# Altium schematic sheet RP2040_Extender.SchDoc: STM32F446 CNC
size B; Author: AM; CompanyName: Expatria Technologies; DrawnBy: A.Marles; Engineer: AM; Organization: Expatria Technologies; DocumentNumber: 3; SheetNumber: 3; SheetTotal: 14
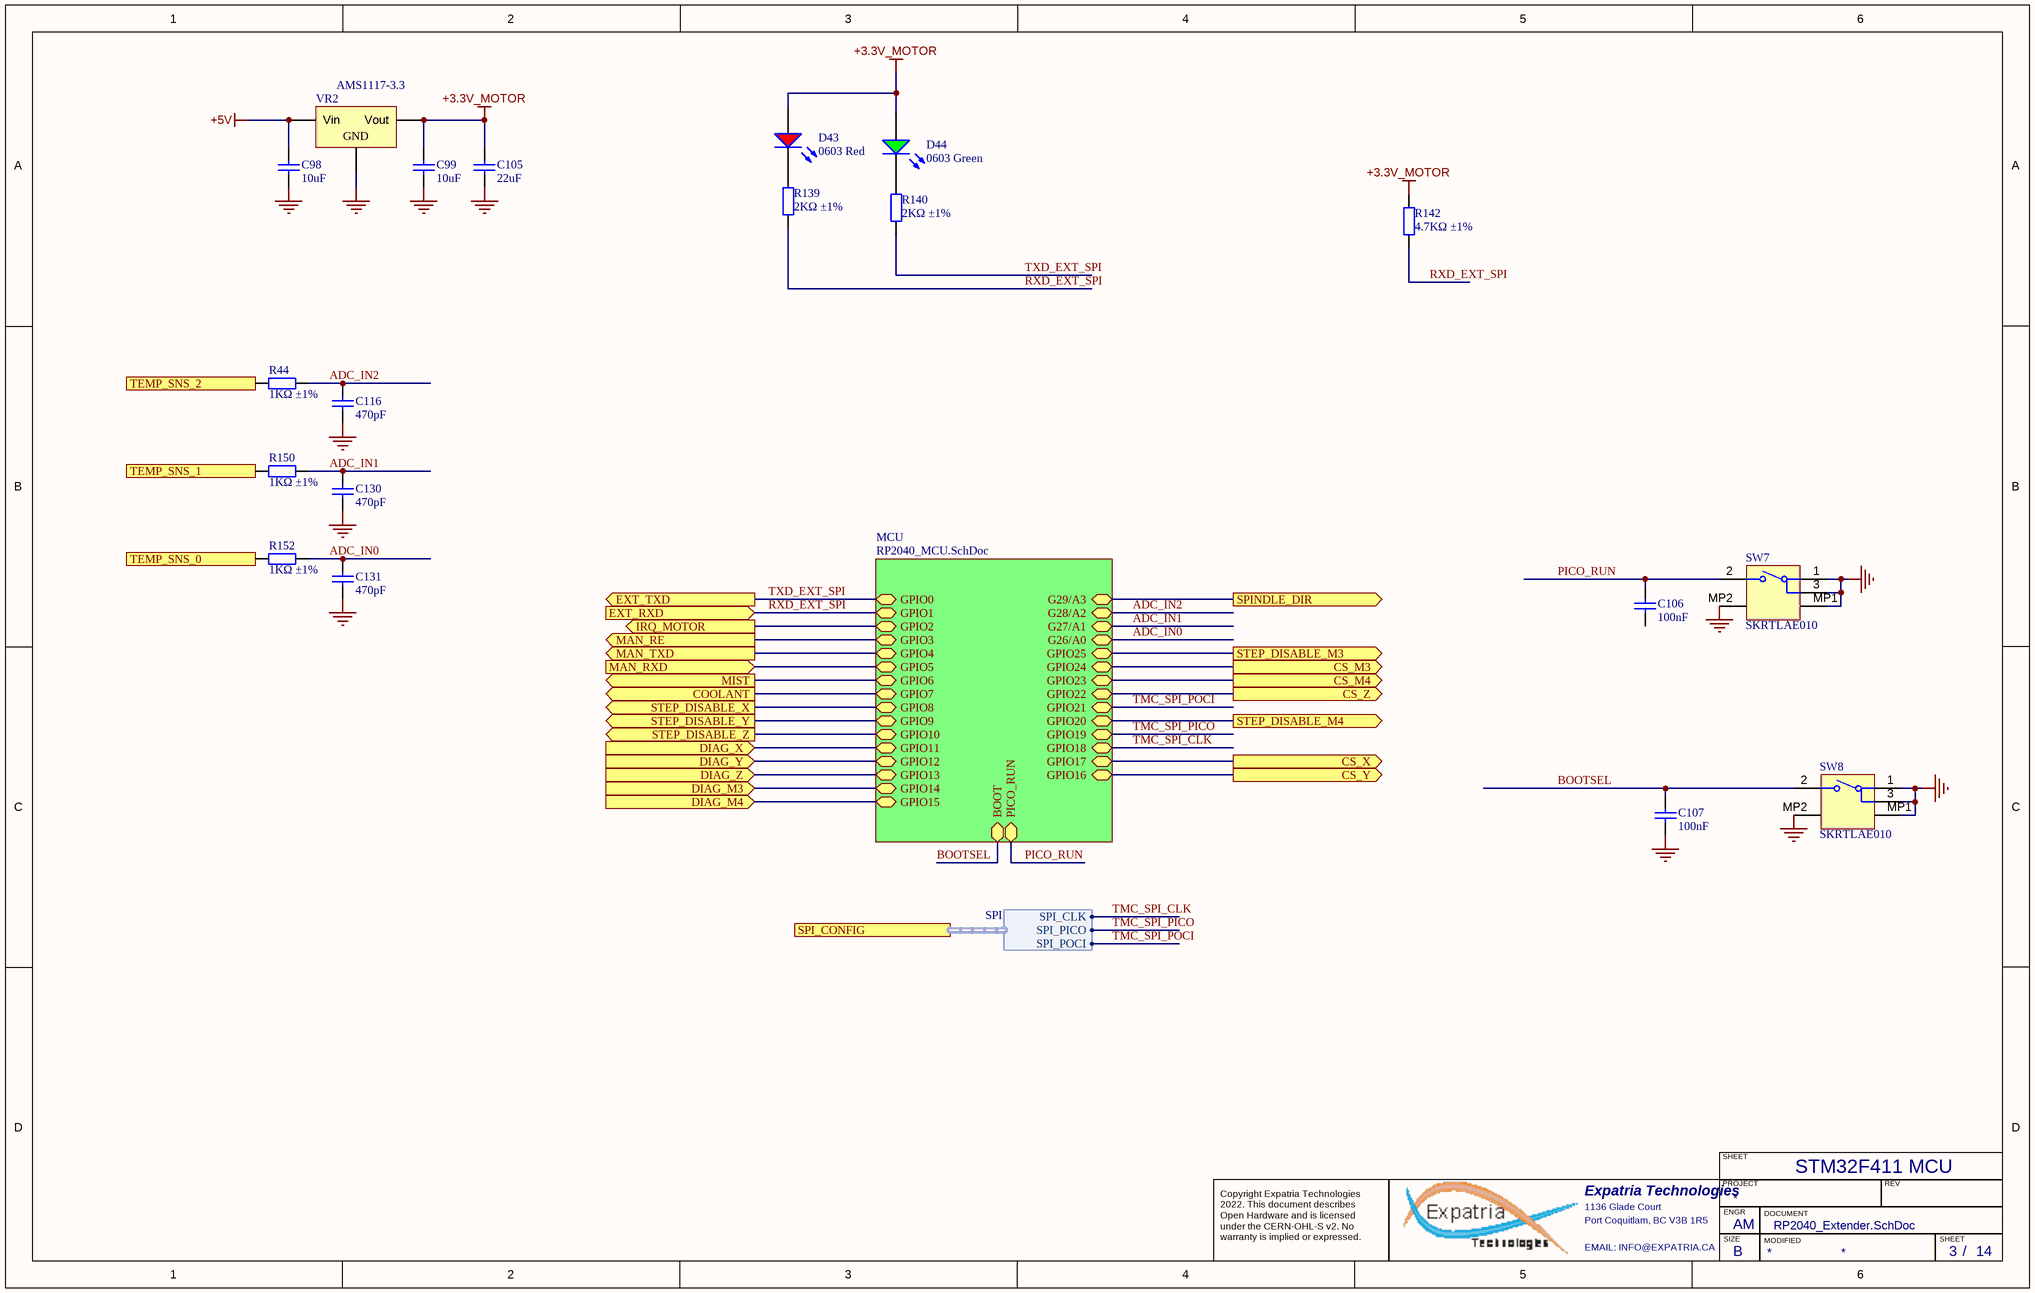
[diagram p0: RP2040_Extender.SchDoc]

## Parts
C98  10uF  [1206_C]
C99  10uF  [1206_C]
C105  22uF  [0805_C]
C106  100nF  [0402_C]  (no BOM)
C107  100nF  [0402_C]  (no BOM)
C116  470pF  [0603_C]
C130  470pF  [0603_C]
C131  470pF  [0603_C]
D43  0603 Red  [0603_LED_S1]
D44  0603 Green  [0603_LED_S1]
R44  1KΩ ±1%  [0603_R]
R139  2KΩ ±1%  [0603_R]
R140  2KΩ ±1%  [0603_R]
R142  4.7KΩ ±1%  [0603_R]
R150  1KΩ ±1%  [0603_R]
R152  1KΩ ±1%  [0603_R]
SW7  SKRTLAE010  [ALPS-SKRTLAE010_V]
SW8  SKRTLAE010  [ALPS-SKRTLAE010_V]
VR2  AMS1117-3.3  [SOT-223]

## Sub-sheets
MCU = RP2040_MCU.SchDoc: G28/A2 (bidir), GPIO20 (bidir), GPIO14 (bidir), GPIO25 (bidir), GPIO15 (bidir), GPIO8 (bidir), GPIO1 (bidir), G27/A1 (bidir), GPIO0 (bidir), GPIO13 (bidir), G26/A0 (bidir), GPIO21 (bidir), PICO_RUN (bidir), G29/A3 (bidir), GPIO7 (bidir), GPIO6 (bidir), GPIO12 (bidir), GPIO2 (bidir), GPIO4 (bidir), GPIO17 (bidir), GPIO10 (bidir), GPIO11 (bidir), GPIO23 (bidir), GPIO22 (bidir), GPIO18 (bidir), GPIO5 (bidir), GPIO9 (bidir), GPIO3 (bidir), GPIO24 (bidir), GPIO19 (bidir), GPIO16 (bidir), BOOT (bidir)

## Ports
COOLANT (out), CS_M3 (out), CS_M4 (out), CS_X (out), CS_Y (out), CS_Z (out), DIAG_M3 (in), DIAG_M4 (in), DIAG_X (in), DIAG_Y (in), DIAG_Z (in), EXT_RXD (in), EXT_TXD (out), IRQ_MOTOR (out), MAN_RE (out), MAN_RXD (in), MAN_TXD (out), MIST (out), SPI_CONFIG (harness SPI), SPINDLE_DIR (out), STEP_DISABLE_M3 (out), STEP_DISABLE_M4 (out), STEP_DISABLE_X (out), STEP_DISABLE_Y (out), STEP_DISABLE_Z (out), TEMP_SNS_0 (in), TEMP_SNS_1 (in), TEMP_SNS_2 (in)

## Harnesses
SPI: SPI_CLK, SPI_PICO, SPI_POCI

## Nets
+3.3V_MOTOR: C99.2 C105.2 D43.A D44.A R142.2 VR2.2(Vout)
+5V: C98.2 VR2.3(Vin)
GND: C98.1 C99.1 C105.1 C107.1 C116.1 C130.1 C131.1 SW7.1 SW7.3 SW7.MP1 SW7.MP2 SW8.1 SW8.3 SW8.MP1 SW8.MP2 VR2.1(GND)
ADC_IN0: C131.2 R152.2 ; sheet MCU/G26/A0
ADC_IN1: C130.2 R150.2 ; sheet MCU/G27/A1
ADC_IN2: C116.2 R44.2 ; sheet MCU/G28/A2
BOOTSEL: C107.2 SW8.2 ; sheet MCU/BOOT
COOLANT: port COOLANT, sheet MCU/GPIO7
CS_M3: port CS_M3, sheet MCU/GPIO24
CS_M4: port CS_M4, sheet MCU/GPIO23
CS_X: port CS_X, sheet MCU/GPIO17
CS_Y: port CS_Y, sheet MCU/GPIO16
CS_Z: port CS_Z, sheet MCU/GPIO22
DIAG_M3: port DIAG_M3, sheet MCU/GPIO14
DIAG_M4: port DIAG_M4, sheet MCU/GPIO15
DIAG_X: port DIAG_X, sheet MCU/GPIO11
DIAG_Y: port DIAG_Y, sheet MCU/GPIO12
DIAG_Z: port DIAG_Z, sheet MCU/GPIO13
IRQ_MOTOR: port IRQ_MOTOR, sheet MCU/GPIO2
MAN_RE: port MAN_RE, sheet MCU/GPIO3
MAN_RXD: port MAN_RXD, sheet MCU/GPIO5
MAN_TXD: port MAN_TXD, sheet MCU/GPIO4
MIST: port MIST, sheet MCU/GPIO6
PICO_RUN: C106.2 SW7.2 ; sheet MCU/PICO_RUN
RXD_EXT_SPI: R139.1 R142.1 ; port EXT_RXD, sheet MCU/GPIO1
SPINDLE_DIR: port SPINDLE_DIR, sheet MCU/G29/A3
STEP_DISABLE_M3: port STEP_DISABLE_M3, sheet MCU/GPIO25
STEP_DISABLE_M4: port STEP_DISABLE_M4, sheet MCU/GPIO20
STEP_DISABLE_X: port STEP_DISABLE_X, sheet MCU/GPIO8
STEP_DISABLE_Y: port STEP_DISABLE_Y, sheet MCU/GPIO9
STEP_DISABLE_Z: port STEP_DISABLE_Z, sheet MCU/GPIO10
TEMP_SNS_0: R152.1 ; port TEMP_SNS_0
TEMP_SNS_1: R150.1 ; port TEMP_SNS_1
TEMP_SNS_2: R44.1 ; port TEMP_SNS_2
TMC_SPI_CLK: sheet MCU/GPIO18, port SPI_CONFIG.SPI_CLK
TMC_SPI_PICO: sheet MCU/GPIO19, port SPI_CONFIG.SPI_PICO
TMC_SPI_POCI: sheet MCU/GPIO21, port SPI_CONFIG.SPI_POCI
TXD_EXT_SPI: R140.1 ; port EXT_TXD, sheet MCU/GPIO0
NetD43_K: D43.K R139.2
NetD44_K: D44.K R140.2

Not connected (* = marked no-connect by the designer): C106 1

## Notes on the sheet
- STM32F411 MCU
- SHEET
- Expatria Technologies
- 1136 Glade Court
- Port Coquitlam, BC V3B 1R5
- PROJECT
- SIZE
- ENGR
- MODIFIED
- DOCUMENT
- REV
- Copyright Expatria Technologies 2022. This document describes Open Hardware and is licensed under the CERN-OHL-S v2. No warranty is implied or expressed.
- EMAIL: INFO@EXPATRIA.CA
- B
- /

## Library data of the parts
C98 C99 = 1206 10uF (106) 10% 50V: Chip capacitors; Manufacturer: Samsung Electro-Mechanics; PartNumber: CL31A106KBHNNNE; Tolerance: 10%; Voltage: 50V; ComponentLink1Description: Supplier link; ComponentLink1URL: http://www.szlcsc.com/product/details_14236.html; Package: 1206; Supplier: LC; SuppliersPartNumber: C13585; Capacitance: 10uF; Manufacturer 1: Samsung Electro-Mechanics
C105 = 0805 22uF (226) 20% 25V: Chip capacitors; Manufacturer: Samsung Electro-Mechanics; PartNumber: CL21A226MAQNNNE; Tolerance: 20%; Voltage: 25V; Package: 0805; Supplier: LC; SuppliersPartNumber: C2922481; Capacitance: 22uF; ComponentLink1Description: Supplier link; ComponentLink1URL: http://www.szlcsc.com/product/details_46786.html
C106 C107 = 0402 100nF (104) 10% 16V: Chip capacitors; Manufacturer: Samsung Electro-Mechanics; PartNumber: CL05B104KO5NNNC; Tolerance: 10%; Voltage: 16V; ComponentLink1Description: Supplier link; ComponentLink1URL: http://www.szlcsc.com/product/details_1877.html; Package: 0402; Supplier: LC; SuppliersPartNumber: C1525; Capacitance: 100nF
C116 C130 C131 = 0603 470pF (471) 10% 50V: Chip capacitors; Manufacturer: Guangdong Fenghua Advanced Tech; PartNumber: 0603B471K500NT; Tolerance: 10%; Voltage: 50V; ComponentLink1Description: Supplier link; ComponentLink1URL: http://www.szlcsc.com/product/details_1972.html; Package: 0603; Supplier: LC; SuppliersPartNumber: C1620; Capacitance: 470pF
D43 = 0603 LED Red: LED; ComponentLink1Description: 供应商链接; ComponentLink1URL: http://www.szlcsc.com/product/details_2659.html; Package: 0603; Supplier: LC; SuppliersPartNumber: C2286; Color: Red
D44 = 0603 LED Green: LED; ComponentLink1Description: 供应商链接; ComponentLink1URL: http://www.szlcsc.com/product/details_73152.html; Package: 0603; Supplier: LC; SuppliersPartNumber: C72043; Color: Green
R44 R150 R152 = 0603 1K (1001) 1%: Chip resistor; Manufacturer: Uniroyal Elec; PartNumber: 0603WAF1001T5E; Power: 1/10W; ComponentLink1Description: Supplier link; ComponentLink1URL: http://www.szlcsc.com/product/details_21904.html; Package: 0603; Supplier: LC; SuppliersPartNumber: C21190; Resistance: 1KΩ; Tolerance: 1%
R139 R140 = 0603 2K (2001) 1%: Chip resistor; Manufacturer: Uniroyal Elec; PartNumber: 0603WAF2001T5E; Power: 1/10W; ComponentLink1Description: Supplier link; ComponentLink1URL: http://www.szlcsc.com/product/details_23702.html; Package: 0603; Supplier: LC; SuppliersPartNumber: C22975; Resistance: 2KΩ; Tolerance: 1%
R142 = 0603 4.7K (4701) 1%: Chip resistor; Manufacturer: Uniroyal Elec; PartNumber: 0603WAF4701T5E; Power: 1/10W; ComponentLink1Description: Supplier link; ComponentLink1URL: http://www.szlcsc.com/product/details_23889.html; Package: 0603; Supplier: LC; SuppliersPartNumber: C23162; Resistance: 4.7KΩ; Tolerance: 1%
SW7 SW8 = CMP-2000-07073-2: Side Push Type, 250 V, -40 to 90 degC, 3-Pin SMD, RoHS, Tape and Reel; Manufacturer: ALPS; Operating Force: 1.6N; Folder: Unified Components\Components\New Releases\New\; Maximum Current Rating: 0.05@12VDCA; RevisionId: 1; Pole Throw Configuration: SPST; Switch Configuration: N.O.; AccessRights: 2147483647; Maximum DC Voltage Rating: 12V; ContentType: Unified Component; Rad Hard: No; Mounting: SurfaceMount; Datasheet URL: http://www.alps.com/prod/info/E/PDF/Tact/SurfaceMount/SKRT/SKRT.PDF; Manufacturer URL: http://www.alps.com/e/; ReleaseDate: 22/09/2017 06:13:25 AM; ItemHRID: CMP-2000-07073; ContentTypeGUID: CB3C11C4-E317-11DF-B822-12313F0024A2; LifeCycle: Released; ItemGUID: EAC55BEC-37DC-4BDB-8BA7-D75E6D5C3D75; Packaging: Tape&Reel; Package Reference: SKRTLAE010; FolderGUID: B7F4506A-9127-42E7-A087-46FE7B18D116; Datasheet Version: 06/2015; Mounting Technology: SurfaceMount; LifeCycleStateGUID: 61E382EE-6656-4F12-9E24-BE9327104A25; Package Description: 3-Pin Surface Mount Device, Body 4.5 x 3.55 mm, Pitch 1.225 mm; SuppliersPartNumber: C110293
VR2 = SOT-223 AMS1117-3.3: Vout=3.3V 1A 72dB@(120Hz) (LDO); Manufacturer 1: AMS; ComponentLink1Description: 供应商链接; ComponentLink1URL: http://www.szlcsc.com/product/details_6652.html; Package: SOT-223; Supplier: LC; SuppliersPartNumber: C6186; Manufacturer Part Number 1: AMS1117-3.3